# Altium schematic sheet Control_Board.SchDoc
size A
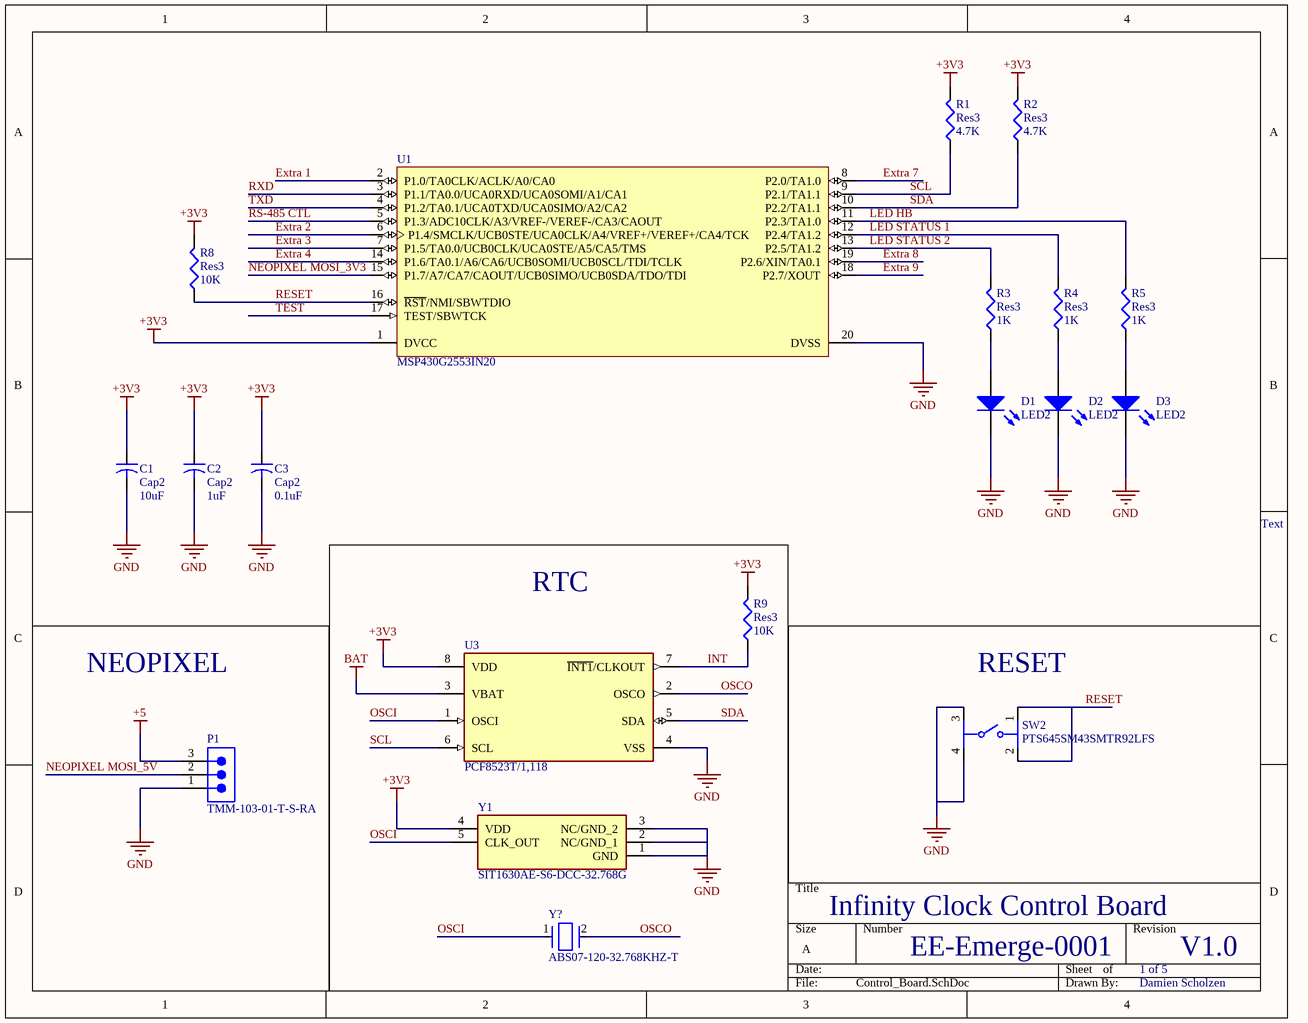
[diagram p0: Control_Board.SchDoc]

## Parts
C1  Cap2  value 10uF  [C0805]
C2  Cap2  value 1uF  [C0805]
C3  Cap2  value 0.1uF  [C0805]
D1  LED2  [3.2X1.6X1.1]
D2  LED2  [3.2X1.6X1.1]
D3  LED2  [3.2X1.6X1.1]
P1  TMM-103-01-T-S-RA  [SMTC-TMM-103-01-X-S-RA]
R1  Res3  value 4.7K  [6-0805_N]
R2  Res3  value 4.7K  [6-0805_N]
R3  Res3  value 1K  [6-0805_N]
R4  Res3  value 1K  [6-0805_N]
R5  Res3  value 1K  [6-0805_N]
R8  Res3  value 10K  [6-0805_N]
R9  Res3  value 10K  [6-0805_N]
SW2  PTS645SM43SMTR92LFS  [FP-PTS645SM43SMTR92LFS-MFG]
U1  MSP430G2553IN20  [N0020A]
U3  PCF8523T/1,118  [FP-SOT96-1-IPC_B]
Y1  SIT1630AE-S6-DCC-32.768G  [SIT1630AES6DCC32768G]
Y?  ABS07-120-32.768KHZ-T  [FP-ABS07-120-MFG]

## Nets
+3V3: C1.1 C2.1 C3.1 R1.2 R2.2 R8.2 R9.2 U1.1(DVCC) U3.8(VDD) Y1.4(VDD)
+5: P1.3
BAT: U3.3(VBAT)
GND: C1.2 C2.2 C3.2 D1.2(K) D2.2(K) D3.2(K) P1.1 SW2.3 SW2.4 U1.20(DVSS) U3.4(VSS) Y1.1(GND) Y1.2(NC/GND_1) Y1.3(NC/GND_2)
Extra 1: U1.2(P1.0/TA0CLK/ACLK/A0/CA0)
Extra 2: U1.6(P1.4/SMCLK/UCB0STE/UCA0CLK/A4/VREF+/VEREF+/CA4/TCK)
Extra 3: U1.7(P1.5/TA0.0/UCB0CLK/UCA0STE/A5/CA5/TMS)
Extra 4: U1.14(P1.6/TA0.1/A6/CA6/UCB0SOMI/UCB0SCL/TDI/TCLK)
Extra 7: U1.8(P2.0/TA1.0)
Extra 8: U1.19(P2.6/XIN/TA0.1)
Extra 9: U1.18(P2.7/XOUT)
INT: R9.1 U3.7(~{INT1}/CLKOUT)
LED HB: R5.2 U1.11(P2.3/TA1.0)
LED STATUS 1: R4.2 U1.12(P2.4/TA1.2)
LED STATUS 2: R3.2 U1.13(P2.5/TA1.2)
NEOPIXEL MOSI_3V3: U1.15(P1.7/A7/CA7/CAOUT/UCB0SIMO/UCB0SDA/TDO/TDI)
NEOPIXEL MOSI_5V: P1.2
OSCI: U3.1(OSCI) Y1.5(CLK_OUT) Y?.1
OSCO: U3.2(OSCO) Y?.2
RESET: R8.1 SW2.1 SW2.2 U1.16(~{RST}/NMI/SBWTDIO)
RS-485 CTL: U1.5(P1.3/ADC10CLK/A3/VREF-/VEREF-/CA3/CAOUT)
RXD: U1.3(P1.1/TA0.0/UCA0RXD/UCA0SOMI/A1/CA1)
SCL: R1.1 U1.9(P2.1/TA1.1) U3.6(SCL)
SDA: R2.1 U1.10(P2.2/TA1.1) U3.5(SDA)
TEST: U1.17(TEST/SBWTCK)
TXD: U1.4(P1.2/TA0.1/UCA0TXD/UCA0SIMO/A2/CA2)
NetD1_1: D1.1(A) R3.1
NetD2_1: D2.1(A) R4.1
NetD3_1: D3.1(A) R5.1

## Notes on the sheet
- Text
- RTC
- NEOPIXEL
- RESET
- Infinity Clock Control Board
- EE-Emerge-0001
- 1 of 5
- V1.0
- Damien Scholzen

## Library data of the parts
C1 = Cap2: Capacitor; Published: 23-Sep-2002; PackageReference: CAPR5-4X5; Publisher: Altium Limited; PackageDescription: Capacitor; 2 Leads
C2 = Cap2_1: Capacitor; Published: 23-Sep-2002; PackageReference: CAPR5-4X5; Publisher: Altium Limited; PackageDescription: Capacitor; 2 Leads
C3 = Cap2_2: Capacitor; Published: 23-Sep-2002; PackageReference: CAPR5-4X5; Publisher: Altium Limited; PackageDescription: Capacitor; 2 Leads
D1-D3 = LED2: Typical RED, GREEN, YELLOW, AMBER GaAs LED; Published: 8-Jun-2000; LatestRevisionDate: 17-Jul-2002; LatestRevisionNote: Re-released for DXP Platform.; PackageVersion: Feb-2002; PackageReference: 3.2X1.6X1.1; Publisher: Altium Limited; PackageDescription: SM LED; 2 Flat Leads
P1 = CMP-1029-00176-1: Low Profile Through-Hole Header, Right Angle, -55 to 105 degC, 2 mm Pitch, 3-Pin, Male, RoHS; Manufacturer: Samtec; Pitch: 2 mm; PackageDescription: 2 mm Terminal Strip Assembly (R/A); Mounting Technology: Through-hole; ComponentLink3URL: http://www.samtec.com/documents/webfiles/cpdf/TMM-1XX-XX-XX-X-RA-XXX-MKT.pdf; RoHS: True; Temperature Range: -55 to 105 degC; PackageVersion: V, 3/2013; ComponentLink3Description: Package Specification; ComponentLink1Description: Manufacturer URL; ComponentLink2Description: Datasheet; PackageReference: TMM-103-01-X-S-RA; ComponentLink1URL: http://www.samtec.com; PartNumber: TMM-103-01-T-S-RA; DatasheetVersion: F-214; Orientation: Right Angle; ComponentLink2URL: http://d2a072wq521u33.cloudfront.net/catalog_english//TMM_TH.PDF; Manufacturer 1: Samtec; Manufacturer Part Number 1: TMM-103-01-T-S-RA
R1 R2 = Res3_1: Resistor; Published: 8-Jun-2000; LatestRevisionDate: 29-May-2009; LatestRevisionNote: IPC-7351 Footprint Added.; PackageReference: J1-0603; Publisher: Altium Limited; PackageDescription: Chip Resistor
R3-R5 = Res3_2: Resistor; Published: 8-Jun-2000; LatestRevisionDate: 29-May-2009; LatestRevisionNote: IPC-7351 Footprint Added.; PackageReference: J1-0603; Publisher: Altium Limited; PackageDescription: Chip Resistor
R8 R9 = Res3_3: Resistor; Published: 8-Jun-2000; LatestRevisionDate: 29-May-2009; LatestRevisionNote: IPC-7351 Footprint Added.; PackageReference: J1-0603; Publisher: Altium Limited; PackageDescription: Chip Resistor
SW2 = CMP-2000-05160-2: SWITCH TACTILE SPST-NO 0.05A 12V; Contact Resistance: 100mR; Throw Configuration: SPST; Illumination Type: Non-Illuminated; Mechanical Life: 100000Cycles; Current Rating: 50mA; Switch Function: Off-Mom; Actuator Length: 0.85mm; Actuator Material: Nylon; Actuator Type: Standard; Operating Force: 160gf; Min Operating Temperature: -20°C; REACH SVHC: No SVHC; Termination: Gull Wing; Case/Package: SMD/SMT; Packaging: Tape and Reel; Mount: Surface Mount; Voltage Rating (DC): 12V; Orientation: Straight; Lead Free: Lead Free; Contact Material: Silver; Color: Black; Max Current Rating: 50mA; Contact Plating: Silver; Depth: 9mm; Package Quantity: 1; Max Voltage Rating (DC): 12V; Length: 6mm; Max Operating Temperature: 60°C
U1 = CMP-0365-00184-2: 16 MHz Mixed Signal Microcontroller with 16 KB Flash, 512 B SRAM and 24 GPIOs, -40 to 85 degC, 20-pin DIP (N), Pb-Free (RoHS); Manufacturer: Texas Instruments; USCI_B (I2C & SPI): 1; Temp Sensor: Yes; SubFamily: Value Line; Frequency(MHz): 16; ADC Channels: 8; SRAM(B): 512; ADC: 10-bit SAR; GPIO: 24; Timers - 16-bit: 2; Code_JEDEC: MS-001; Eco-Plan: Pb-Free (RoHS); PartNumber: MSP430G2553IN20; ComponentLink1URL: http://www.ti.com/; PackageVersion: 4040049/E; Comparators: Yes; Watchdog: Yes; ComponentLink2Description: Datasheet; ComponentLink1Description: Manufacturer URL; Mounting Technology: Through Hole; ComponentLink2URL: http://www.ti.com/general/docs/lit/getliterature.tsp?genericPartNumber=MSP430G2553&fileType=pdf; Brown Out Reset: Yes; PackageReference: N0020A; PackageDescription: 20-Pin Plastic In-Line, Body 25.40 x 6.35 mm, Pitch 2.54 mm; ComponentLink3URL: http://www.ti.com/litv/pdf/mpds177g; ComponentLink3Description: Package Specification; Flash(KB): 16; Cap touch I/O: Yes; USCI_A (UART/LIN/IrDA/SPI): 1; DatasheetVersion: SLAS735G; Manufacturer 1: Texas Instruments; Manufacturer Part Number 1: MSP430G2553IN20
U3 = CMP-10083-000014-1: IC RTC CLK/CALENDAR I2C 8-SOIC; Time Format: HH:MM:SS; Min Supply Voltage: 1.2V; Max Supply Voltage: 5.5V; Logic Function: Clock; Min Operating Temperature: -40°C; Case/Package: SO; Radiation Hardening: No; Interface: I2C; Max Operating Temperature: 85°C; Contact Plating: Gold; Packaging: Tape and Reel; Package Quantity: 2500; Lead Free: Lead Free; Number of Pins: 8; Mount: Surface Mount; REACH SVHC: No SVHC
Y1 = SIT1630AE-S6-DCC-32.768G: Crystal or Oscillator; Manufacturer_Name: SiTime; Datasheet Link: https://www.sitime.com/datasheet/SiT1630; Height: 1.45mm; Manufacturer_Part_Number: SIT1630AE-S6-DCC-32.768G; Mouser Part Number: 788-163AES6DCC32768G; Mouser Price/Stock: https://www.mouser.co.uk/ProductDetail/SiTime/SIT1630AE-S6-DCC-32768G?qs=BJlw7L4Cy791CjDMNa%252B%2Fjg%3D%3D
Y? = CMP-2000-07587-2: CRYSTAL 32.7680KHZ 6PF SMD; Frequency Tolerance: 20ppm; Series Resistance: 60kR; ESR (Equivalent Series Resistance): 55kR; Depth: 1.5mm; Width: 0.061inch; Number of Pins: 2; Max Operating Temperature: 85°C; Length: 3.2mm; Case/Package: SMD/SMT; Series: ABS07; Lead Free: Lead Free; Min Operating Temperature: -40°C; Load Capacitance: 6pF; Packaging: Tape and Reel; Height: 0.035inch; Radiation Hardening: No; Tolerance: 20ppm; Operating Frequency: 32.768 kHz; Termination: SMD/SMT; REACH SVHC: No SVHC; RoHS Compliant: Yes; Frequency: 32.768kHz; Package Quantity: 3000; Mount: Surface Mount